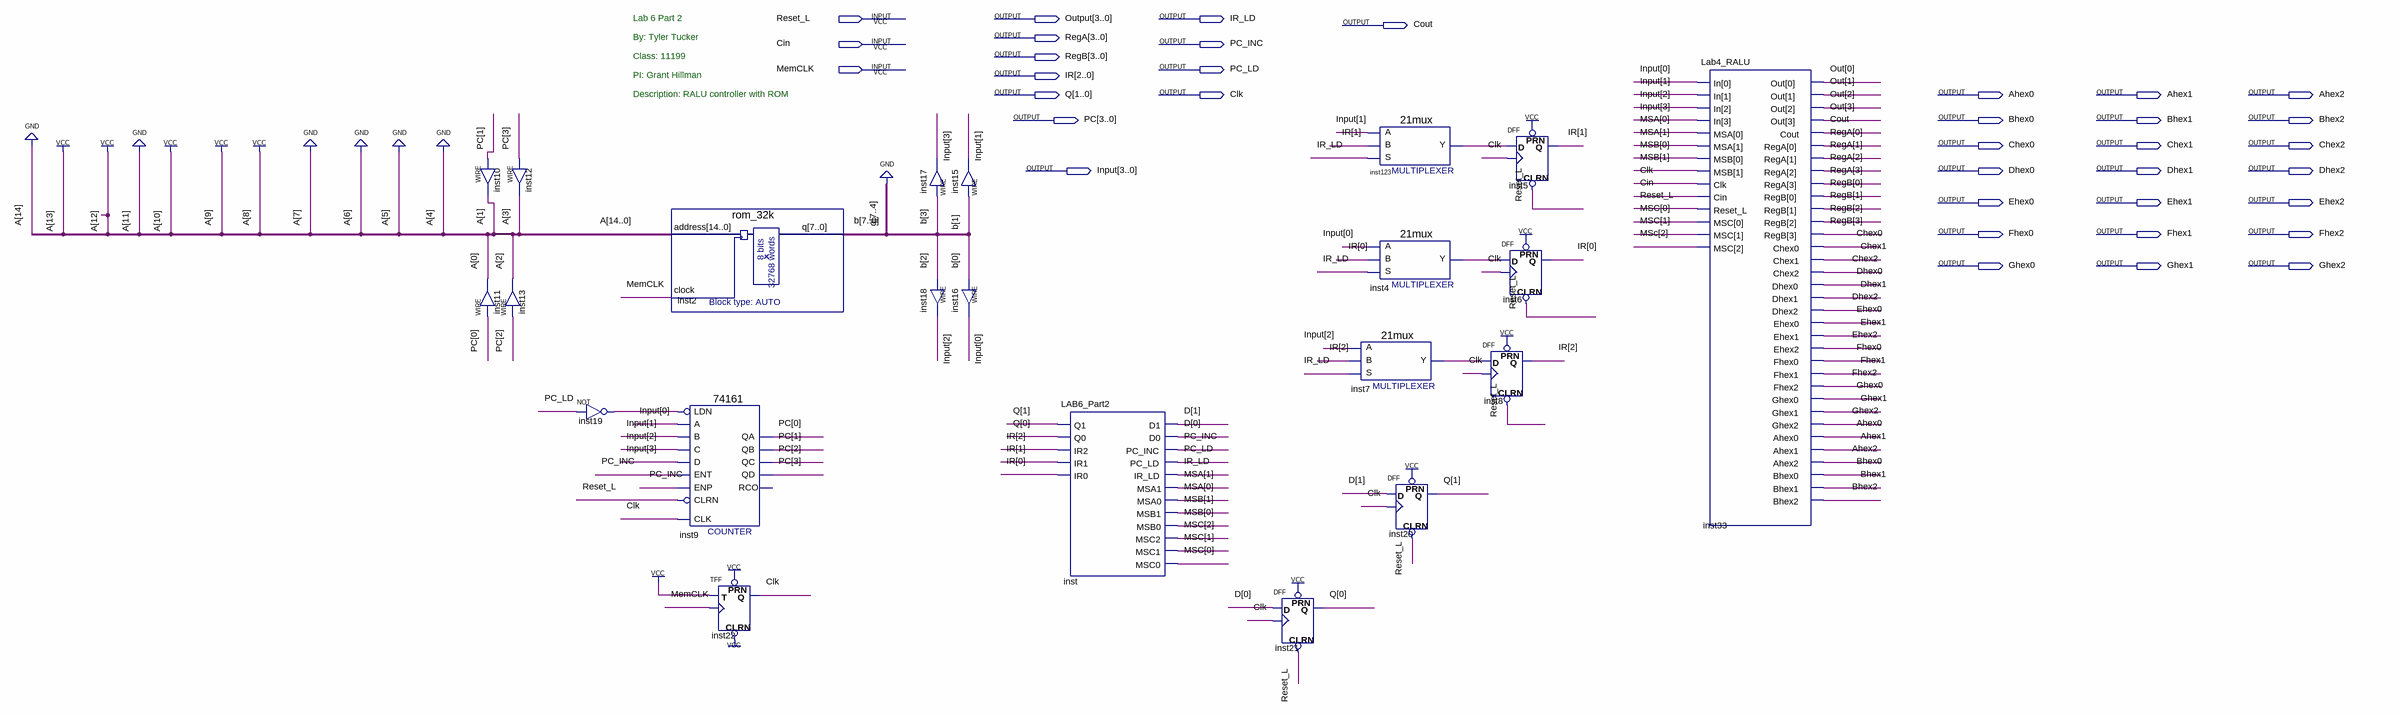
[diagram p0: schematic sheet]
// Quartus schematic Block1.bdf as structural Verilog: 22 symbols, 36 pins
module Block1 (
  input  Reset_L,
  input  Cin,
  input  MemCLK,
  output [3:0] Output,
  output IR_LD,
  output Cout,
  output [3:0] RegA,
  output PC_INC,
  output [3:0] RegB,
  output PC_LD,
  output [2:0] IR,
  output [1:0] Q,
  output Clk,
  output Ahex0,
  output Ahex1,
  output Ahex2,
  output [3:0] PC,
  output Bhex0,
  output Bhex1,
  output Bhex2,
  output Chex0,
  output Chex1,
  output Chex2,
  output [3:0] Input,
  output Dhex0,
  output Dhex1,
  output Dhex2,
  output Ehex0,
  output Ehex1,
  output Ehex2,
  output Fhex0,
  output Fhex1,
  output Fhex2,
  output Ghex0,
  output Ghex1,
  output Ghex2
);

  wire inst4_y, inst7_y, inst19_out, inst123_y;
  wire [1:0] D, MSA, MSB;
  wire [2:0] MSC;
  wire [3:0] A, Out;
  wire [7:0] b;

  assign A[1] = PC[1];  // WIRE inst10
  assign A[3] = PC[3];  // WIRE inst12
  assign A[0] = PC[0];  // WIRE inst11
  assign A[2] = PC[2];  // WIRE inst13
  not inst19 (inst19_out, PC_LD);
  rom_32k inst2 (.address({11'b01101110000, A}), .clock(MemCLK), .q(b));
  \74161  inst9 (
    .CLRN(Reset_L), .CLK(Clk), .ENP(PC_INC), .LDN(inst19_out), .A(Input[0]), .D(Input[3]), .ENT(PC_INC),
    .B(Input[1]), .C(Input[2]), .QD(PC[3]), .QC(PC[2]), .QB(PC[1]), .QA(PC[0]));  // open: RCO
  TFF inst22 (.PRN(1'b1), .CLRN(1'b1), .T(1'b1), .CLK(MemCLK), .Q(Clk));
  assign Input[3] = b[3];  // WIRE inst17
  assign Input[2] = b[2];  // WIRE inst18
  assign Input[1] = b[1];  // WIRE inst15
  assign Input[0] = b[0];  // WIRE inst16
  LAB6_Part2 inst (
    .Q1(Q[1]), .Q0(Q[0]), .IR2(IR[2]), .IR1(IR[1]), .IR0(IR[0]), .D1(D[1]), .D0(D[0]), .PC_INC(PC_INC),
    .PC_LD(PC_LD), .IR_LD(IR_LD), .MSA1(MSA[1]), .MSA0(MSA[0]), .MSB1(MSB[1]), .MSB0(MSB[0]), .MSC2(MSC[2]),
    .MSC1(MSC[1]), .MSC0(MSC[0]));
  DFF inst21 (.CLRN(Reset_L), .CLK(Clk), .D(D[0]), .PRN(1'b1), .Q(Q[0]));
  \21mux  inst123 (.S(IR_LD), .B(IR[1]), .A(Input[1]), .Y(inst123_y));
  \21mux  inst4 (.S(IR_LD), .B(IR[0]), .A(Input[0]), .Y(inst4_y));
  \21mux  inst7 (.S(IR_LD), .B(IR[2]), .A(Input[2]), .Y(inst7_y));
  DFF inst20 (.CLRN(Reset_L), .CLK(Clk), .D(D[1]), .PRN(1'b1), .Q(Q[1]));
  DFF inst8 (.CLRN(Reset_L), .CLK(Clk), .D(inst7_y), .PRN(1'b1), .Q(IR[2]));
  DFF inst5 (.CLRN(Reset_L), .CLK(Clk), .D(inst123_y), .PRN(1'b1), .Q(IR[1]));
  DFF inst6 (.CLRN(Reset_L), .CLK(Clk), .D(inst4_y), .PRN(1'b1), .Q(IR[0]));
  Lab4_RALU inst33 (
    .In(Input), .MSA(MSA), .MSB(MSB), .Clk(Clk), .Cin(Cin), .Reset_L(Reset_L), .MSC(MSC), .Out(Out),
    .Cout(Cout), .RegA(RegA), .RegB(RegB), .Chex0(Chex0), .Chex1(Chex1), .Chex2(Chex2), .Dhex0(Dhex0),
    .Dhex1(Dhex1), .Dhex2(Dhex2), .Ehex0(Ehex0), .Ehex1(Ehex1), .Ehex2(Ehex2), .Fhex0(Fhex0), .Fhex1(Fhex1),
    .Fhex2(Fhex2), .Ghex0(Ghex0), .Ghex1(Ghex1), .Ghex2(Ghex2), .Ahex0(Ahex0), .Ahex1(Ahex1), .Ahex2(Ahex2),
    .Bhex0(Bhex0), .Bhex1(Bhex1), .Bhex2(Bhex2));

  // Notes on the sheet:
  //   Lab 6 Part 2
  //   By: Tyler Tucker
  //   Class: 11199
  //   PI: Grant Hillman
  //   Description: RALU controller with ROM
endmodule
